# EAGLE schematic valhalla-pump-panel (EAGLE 9.5.1)
Submersible Pump Automation Operation "Valhalla" CLASSIFIED: SECRET, NEED-TO-KNOW-ONLY This is the a schematic of the submersible pump automation panel and outside components.

## Sheet 1 of 2: Mains voltage part
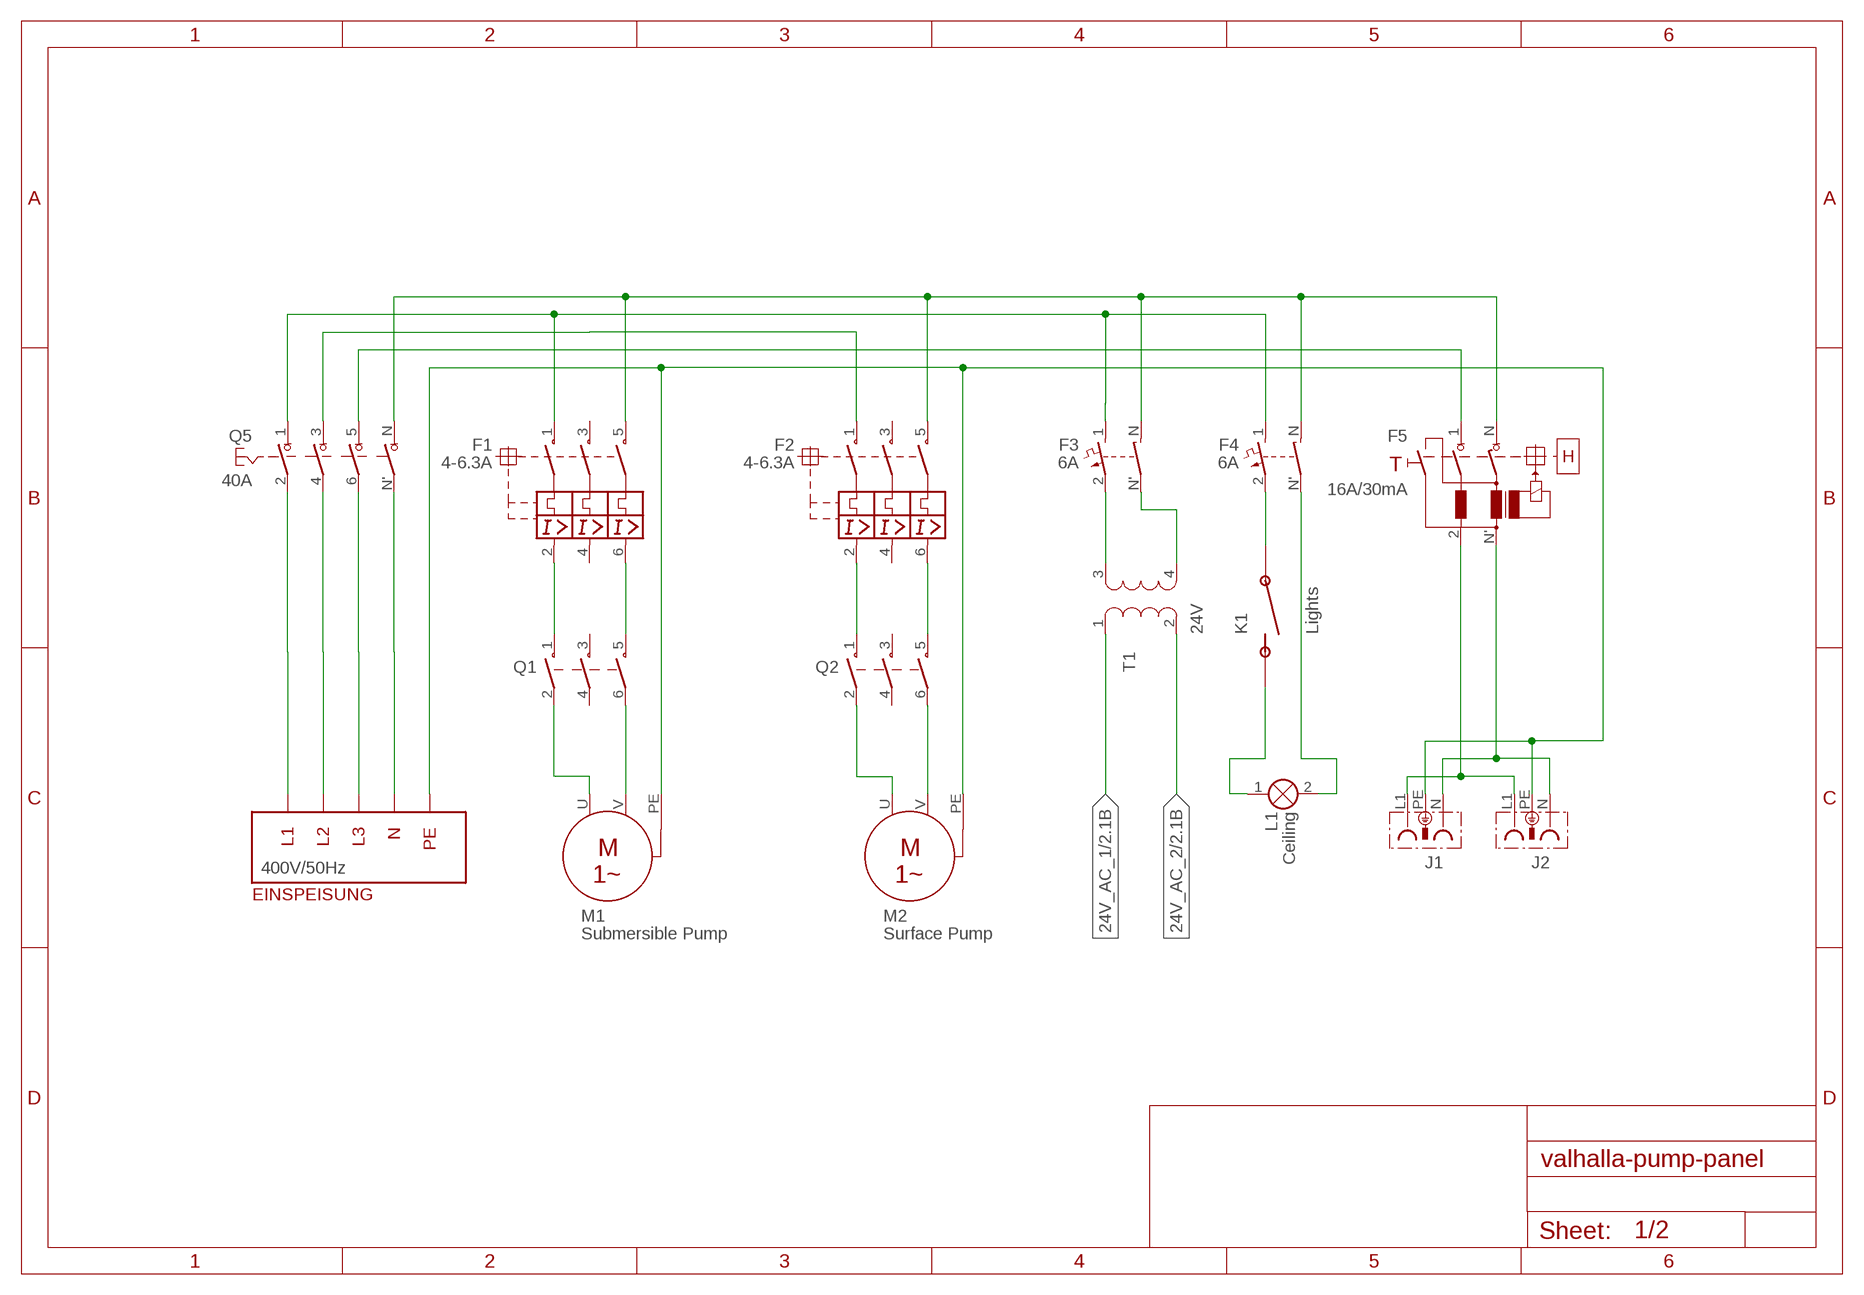
[diagram p0: schematic, sheet 1]

### Parts
F1  4-6.3A  MOTORSCHUTZSCHALTER_3-POL_THERM_MAG_HANDBETAETIGT_HILFSKONTAKTE  [MOTORSCHUTZSCHALTER_3-POL_THERM_MAG_HANDBETAETIGT_HILFSKONTAKTE]
F2  4-6.3A  MOTORSCHUTZSCHALTER_3-POL_THERM_MAG_HANDBETAETIGT_HILFSKONTAKTE  [MOTORSCHUTZSCHALTER_3-POL_THERM_MAG_HANDBETAETIGT_HILFSKONTAKTE]
F3  6A  LEITUNGSSCHUTZSCHALTER_2-POL  [LEITUNGSSCHUTZSCHALTER_2-POL]
F4  6A  LEITUNGSSCHUTZSCHALTER_2-POL  [LEITUNGSSCHUTZSCHALTER_2-POL]
F5  16A/30mA  FEHLER-STROM-SCHUTZSCHALTER_2-POL  [FEHLER-STROM-SCHUTZSCHALTER_2-POL]
J1  STECKDOSE  [STECKDOSE]
J2  STECKDOSE  [STECKDOSE]
L1  Ceiling  SIGNALLAMPE  [LAMPE]
M1  Submersible Pump  MOTOR_1-PHASEN  [MOTOR_1-PHASEN]
M2  Surface Pump  MOTOR_1-PHASEN  [MOTOR_1-PHASEN]
Q1  40A  HAUPTSCHUETZ_3-POL  [HAUPTSCHUETZ_3-POL]
Q2  40A  HAUPTSCHUETZ_3-POL  [HAUPTSCHUETZ_3-POL]
Q5  40A  LASTTRENNSCHALTER_4-POL  [LASTTRENNSCHALTER_4-POL]
T1  TRANSFORMATOR  [TRANSFORMATOR]

### Nets
24V_AC_1: T1.1 ; also sheet 2
24V_AC_2: T1.2 ; also sheet 2
L1-EXT: Q5.2 ; supply symbol labelled 400V/50Hz
L2-EXT: Q5.4 ; supply symbol labelled 400V/50Hz
L3-EXT: Q5.6 ; supply symbol labelled 400V/50Hz
N$1: M1.U Q1.2
N$3: M1.V Q1.6
N$4: F1.2 Q1.1
N$6: F1.6 Q1.5
N$7: F3.N'(N) T1.4
N$8: F5.2 J1.L1 J2.L1
N$9: F2.6 Q2.5
N$11: M2.U Q2.2
N$12: F1.1 F3.1 F4.1 Q5.1
N$13: F2.1 Q5.3
N$14: M2.V Q2.6
N$16: F2.2 Q2.1
N$17: F3.2 T1.3
N$18: F4.N'(N) L1.2(X2)
N$19: F5.1 Q5.5
N$20: F5.N' J1.N J2.N
N$21: F1.5 F2.5 F3.N F4.N F5.N Q5.N
N-EXT: Q5.N' ; supply symbol labelled 400V/50Hz
P$1: F4.2 ; supply symbol labelled Lights ; also sheet 2
P$2: L1.1(X1) ; supply symbol labelled Lights ; also sheet 2
PE-EXT: J1.PE J2.PE M1.PE M2.PE ; supply symbol labelled 400V/50Hz
Unconnected: F1.3 F1.4 F1.95 F1.96 F1.97 F1.98 F2.3 F2.4 F2.95 F2.96 F2.97 F2.98 Q1.3 Q1.4 Q2.3 Q2.4

## Sheet 2 of 2: SELV powered part
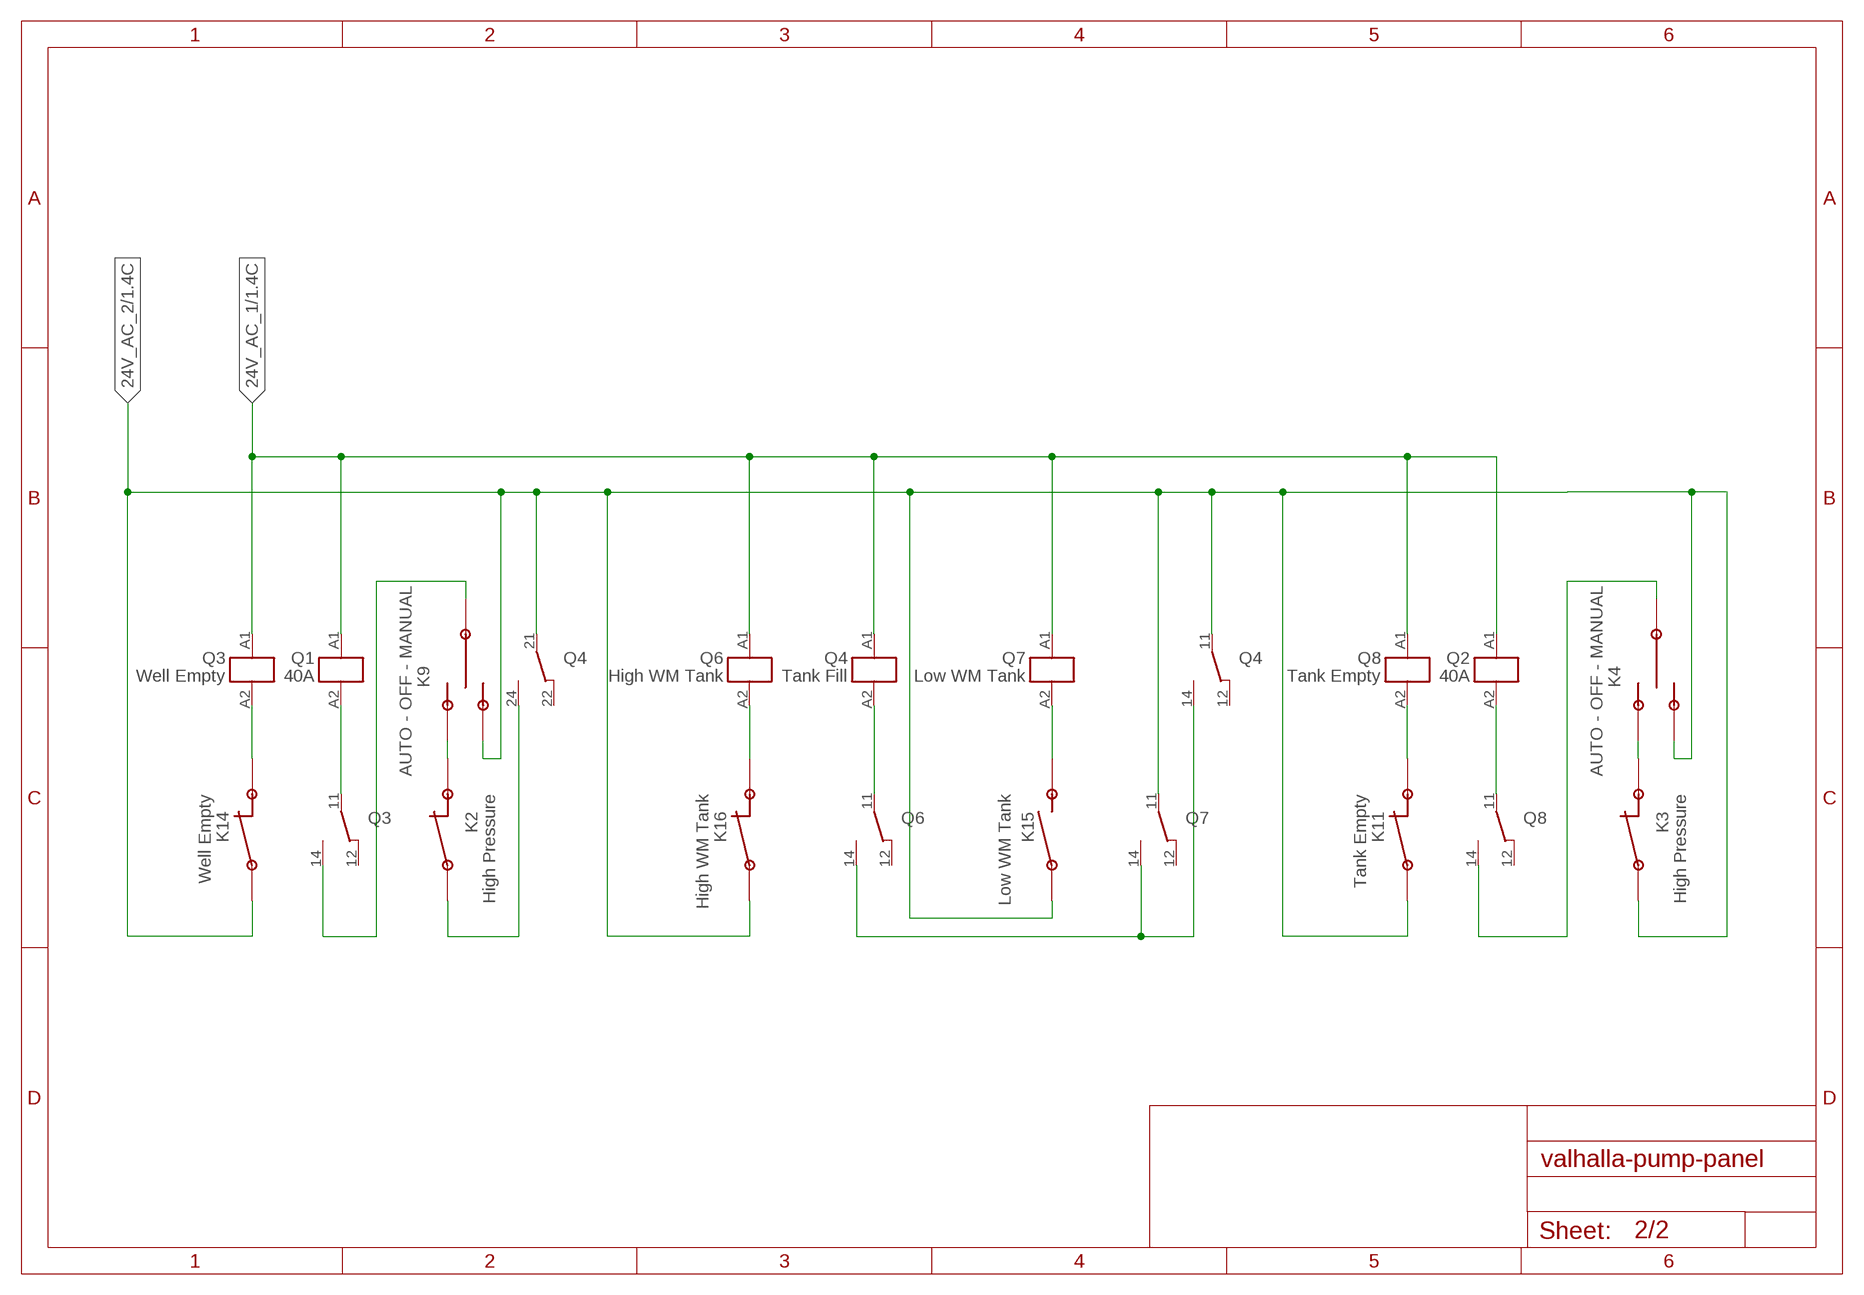
[diagram p1: schematic, sheet 2]

### Parts
Q3  Well Empty  RELAIS_2-POL-UM  [RELAIS_2-POL-UM]
Q4  Tank Fill  RELAIS_2-POL-UM  [RELAIS_2-POL-UM]
Q6  High WM Tank  RELAIS_2-POL-UM  [RELAIS_2-POL-UM]
Q7  Low WM Tank  RELAIS_2-POL-UM  [RELAIS_2-POL-UM]
Q8  Tank Empty  RELAIS_2-POL-UM  [RELAIS_2-POL-UM]

### Nets
24V_AC_1: Q1.A1 Q2.A1 Q3.A1 Q4.A1 Q6.A1 Q7.A1 Q8.A1 ; also sheet 1
24V_AC_2: Q4.11 Q4.21 Q7.11 ; supply symbol labelled Tank Empty, Low WM Tank, High WM Tank, Well Empty, High Pressure ; also sheet 1
N0: Q8.14
N1: Q3.14
N$22: Q1.A2 Q3.11
N$23: Q4.A2 Q6.11
N$24: Q4.14 Q6.14 Q7.14
N$25: Q2.A2 Q8.11
P$1: Q4.24 ; supply symbol labelled High Pressure ; also sheet 1
P$2: Q3.A2 Q6.A2 Q7.A2 Q8.A2 ; supply symbol labelled High Pressure, Well Empty, High WM Tank, Low WM Tank, Tank Empty ; also sheet 1
Unconnected: Q3.12 Q3.21 Q3.22 Q3.24 Q4.12 Q4.22 Q6.12 Q6.21 Q6.22 Q6.24 Q7.12 Q7.21 Q7.22 Q7.24 Q8.12 Q8.21 Q8.22 Q8.24

### Notes on the sheet
- AUTO - OFF - MANUAL | AUTO - OFF - MANUAL

## Library data of the parts
F1 F2 = e-motorschutzschalter:MOTORSCHUTZSCHALTER_3-POL_THERM_MAG_HANDBETAETIGT_HILFSKONTAKTE: Motorschutzschalter 3-pol. mit thermischer Auslösung, Handbetätigt, Hilfskontakte
F3 F4 = e-sicherungen:LEITUNGSSCHUTZSCHALTER_2-POL: Leitungsschutzschalter, 2-pol.
F5 = e-sicherungen:FEHLER-STROM-SCHUTZSCHALTER_2-POL: Fehlerstromschutzschalter (FI) 2-pol mit Prüftaste
J1 = e-steckverbinder:STECKDOSE: Steckdose mit Schutzleiter
J2 = e-steckverbinder:STECKDOSE: Steckdose mit Schutzleiter; SPICEPREFIX: J
L1 = e-lampen-signalisation:SIGNALLAMPE: Lampe
M1 M2 = e-motoren:MOTOR_1-PHASEN: 1-Phasen-Wechselstrom-Motor
Q1 Q2 = e-schuetze-relais:HAUPTSCHUETZ_3-POL: Hauptschütz mit 3 Schließern
Q3 Q4 Q6-Q8 = e-schuetze-relais:RELAIS_2-POL-UM: Relais mit 2 Wechsleschalter
Q5 = e-schalter:LASTTRENNSCHALTER_4-POL: Lasttrennschalter, 4-pol. mit Neutralleiter
T1 = e-spulen-transformatoren:TRANSFORMATOR: Transformator; TYPE: 24V